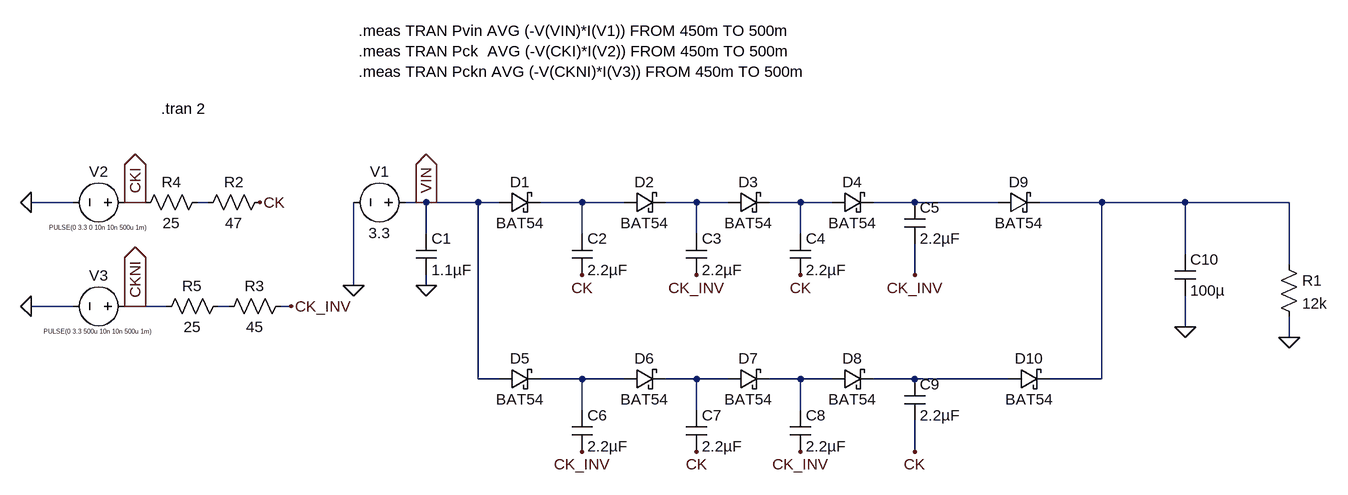
[diagram p0: schematic simulazione_chip_buffer.asc]
simulazione_chip_buffer.asc, the LTspice schematic file:
Version 4
SHEET 1 1172 680
WIRE -768 16 -832 16
WIRE -672 16 -688 16
WIRE -656 16 -672 16
WIRE -560 16 -576 16
WIRE -224 16 -256 16
WIRE -144 16 -224 16
WIRE -112 16 -144 16
WIRE 16 16 -48 16
WIRE 80 16 16 16
WIRE 192 16 144 16
WIRE 240 16 192 16
WIRE 352 16 304 16
WIRE 400 16 352 16
WIRE 528 16 464 16
WIRE 656 16 528 16
WIRE 816 16 720 16
WIRE 944 16 816 16
WIRE 1104 16 944 16
WIRE -224 64 -224 16
WIRE 16 64 16 16
WIRE 192 64 192 16
WIRE 352 64 352 16
WIRE 944 96 944 16
WIRE 1104 112 1104 16
WIRE 528 128 528 80
WIRE -336 144 -336 16
WIRE -224 144 -224 128
WIRE -768 176 -832 176
WIRE -672 176 -688 176
WIRE -624 176 -672 176
WIRE -528 176 -544 176
WIRE -432 176 -448 176
WIRE 944 208 944 160
WIRE 1104 224 1104 192
WIRE -144 288 -144 16
WIRE -112 288 -144 288
WIRE 16 288 -48 288
WIRE 80 288 16 288
WIRE 192 288 144 288
WIRE 240 288 192 288
WIRE 352 288 304 288
WIRE 400 288 352 288
WIRE 528 288 464 288
WIRE 672 288 528 288
WIRE 816 288 816 16
WIRE 816 288 736 288
WIRE 16 336 16 288
WIRE 192 336 192 288
WIRE 352 336 352 288
WIRE 528 400 528 352
FLAG -336 144 0
FLAG -832 176 0
FLAG -832 16 0
FLAG 16 128 CK
FLAG 352 128 CK
FLAG 192 128 CK_INV
FLAG 528 128 CK_INV
FLAG 16 400 CK_INV
FLAG 352 400 CK_INV
FLAG 192 400 CK
FLAG 528 400 CK
FLAG -224 144 0
FLAG 944 208 0
FLAG 1104 224 0
FLAG -480 16 CK
FLAG -432 176 CK_INV
FLAG -224 16 VIN
IOPIN -224 16 Out
FLAG -672 16 CKI
IOPIN -672 16 Out
FLAG -672 176 CKNI
IOPIN -672 176 Out
SYMBOL voltage -240 16 R90
WINDOW 0 -32 56 VBottom 2
WINDOW 3 32 56 VTop 2
WINDOW 123 0 0 Left 0
WINDOW 39 0 0 Left 0
SYMATTR InstName V1
SYMATTR Value 3.3
SYMBOL voltage -672 16 R90
WINDOW 0 -32 56 VBottom 2
WINDOW 3 32 56 VTop 0
WINDOW 123 0 0 Left 0
WINDOW 39 0 0 Left 0
SYMATTR InstName V2
SYMATTR Value PULSE(0 3.3 0 10n 10n 500u 1m)
SYMBOL voltage -672 176 R90
WINDOW 0 -32 56 VBottom 2
WINDOW 3 32 56 VTop 0
WINDOW 123 0 0 Left 0
WINDOW 39 0 0 Left 0
SYMATTR InstName V3
SYMATTR Value PULSE(0 3.3 500u 10n 10n 500u 1m)
SYMBOL schottky -112 32 R270
WINDOW 0 32 32 VTop 2
WINDOW 3 0 32 VBottom 2
SYMATTR InstName D1
SYMATTR Value BAT54
SYMATTR Description Diode
SYMATTR Type diode
SYMBOL schottky 80 32 R270
WINDOW 0 32 32 VTop 2
WINDOW 3 0 32 VBottom 2
SYMATTR InstName D2
SYMATTR Value BAT54
SYMATTR Description Diode
SYMATTR Type diode
SYMBOL schottky 240 32 R270
WINDOW 0 32 32 VTop 2
WINDOW 3 0 32 VBottom 2
SYMATTR InstName D3
SYMATTR Value BAT54
SYMATTR Description Diode
SYMATTR Type diode
SYMBOL schottky 400 32 R270
WINDOW 0 32 32 VTop 2
WINDOW 3 0 32 VBottom 2
SYMATTR InstName D4
SYMATTR Value BAT54
SYMATTR Description Diode
SYMATTR Type diode
SYMBOL cap -240 64 R0
SYMATTR InstName C1
SYMATTR Value 1.1µF
SYMBOL cap 0 64 R0
SYMATTR InstName C2
SYMATTR Value 2.2µF
SYMBOL cap 176 64 R0
SYMATTR InstName C3
SYMATTR Value 2.2µF
SYMBOL cap 336 64 R0
SYMATTR InstName C4
SYMATTR Value 2.2µF
SYMBOL cap 512 16 R0
SYMATTR InstName C5
SYMATTR Value 2.2µF
SYMBOL schottky -112 304 R270
WINDOW 0 32 32 VTop 2
WINDOW 3 0 32 VBottom 2
SYMATTR InstName D5
SYMATTR Value BAT54
SYMATTR Description Diode
SYMATTR Type diode
SYMBOL schottky 80 304 R270
WINDOW 0 32 32 VTop 2
WINDOW 3 0 32 VBottom 2
SYMATTR InstName D6
SYMATTR Value BAT54
SYMATTR Description Diode
SYMATTR Type diode
SYMBOL schottky 240 304 R270
WINDOW 0 32 32 VTop 2
WINDOW 3 0 32 VBottom 2
SYMATTR InstName D7
SYMATTR Value BAT54
SYMATTR Description Diode
SYMATTR Type diode
SYMBOL schottky 400 304 R270
WINDOW 0 32 32 VTop 2
WINDOW 3 0 32 VBottom 2
SYMATTR InstName D8
SYMATTR Value BAT54
SYMATTR Description Diode
SYMATTR Type diode
SYMBOL cap 0 336 R0
SYMATTR InstName C6
SYMATTR Value 2.2µF
SYMBOL cap 176 336 R0
SYMATTR InstName C7
SYMATTR Value 2.2µF
SYMBOL cap 336 336 R0
SYMATTR InstName C8
SYMATTR Value 2.2µF
SYMBOL cap 512 288 R0
SYMATTR InstName C9
SYMATTR Value 2.2µF
SYMBOL schottky 656 32 R270
WINDOW 0 32 32 VTop 2
WINDOW 3 0 32 VBottom 2
SYMATTR InstName D9
SYMATTR Value BAT54
SYMATTR Description Diode
SYMATTR Type diode
SYMBOL schottky 672 304 R270
WINDOW 0 32 32 VTop 2
WINDOW 3 0 32 VBottom 2
SYMATTR InstName D10
SYMATTR Value BAT54
SYMATTR Description Diode
SYMATTR Type diode
SYMBOL cap 928 96 R0
SYMATTR InstName C10
SYMATTR Value 100µ
SYMBOL res 1088 96 R0
SYMATTR InstName R1
SYMATTR Value 12k
SYMBOL res -576 32 R270
WINDOW 0 32 56 VTop 2
WINDOW 3 0 56 VBottom 2
SYMATTR InstName R2
SYMATTR Value 47
SYMBOL res -544 192 R270
WINDOW 0 32 56 VTop 2
WINDOW 3 0 56 VBottom 2
SYMATTR InstName R3
SYMATTR Value 45
SYMBOL res -560 0 R90
WINDOW 0 0 56 VBottom 2
WINDOW 3 32 56 VTop 2
SYMATTR InstName R4
SYMATTR Value 25
SYMBOL res -528 160 R90
WINDOW 0 0 56 VBottom 2
WINDOW 3 32 56 VTop 2
SYMATTR InstName R5
SYMATTR Value 25
TEXT -632 -128 Left 2 !.tran 2
TEXT -328 -248 Left 2 !.meas TRAN Pvin AVG (-V(VIN)*I(V1)) FROM 450m TO 500m\n.meas TRAN Pck  AVG (-V(CKI)*I(V2)) FROM 450m TO 500m\n.meas TRAN Pckn AVG (-V(CKNI)*I(V3)) FROM 450m TO 500m

The netlist it stands for:
* simulazione_chip_buffer.asc
V1 VIN 0 3.3
V2 CKI 0 PULSE(0 3.3 0 10n 10n 500u 1m)
V3 CKNI 0 PULSE(0 3.3 500u 10n 10n 500u 1m)
D1 VIN N002 BAT54
D2 N002 N003 BAT54
D3 N003 N004 BAT54
D4 N004 N005 BAT54
C1 VIN 0 1.1µF
C2 N002 CK 2.2µF
C3 N003 CK_INV 2.2µF
C4 N004 CK 2.2µF
C5 N005 CK_INV 2.2µF
D5 VIN N008 BAT54
D6 N008 N009 BAT54
D7 N009 N010 BAT54
D8 N010 N011 BAT54
C6 N008 CK_INV 2.2µF
C7 N009 CK 2.2µF
C8 N010 CK_INV 2.2µF
C9 N011 CK 2.2µF
D9 N005 N006 BAT54
D10 N011 N006 BAT54
C10 N006 0 100µ
R1 N006 0 12k
R2 N001 CK 47
R3 N007 CK_INV 45
R4 N001 CKI 25
R5 N007 CKNI 25
.model D D
.lib standard.dio
.tran 2
.meas TRAN Pvin AVG (-V(VIN)*I(V1)) FROM 450m TO 500m
.meas TRAN Pck  AVG (-V(CKI)*I(V2)) FROM 450m TO 500m
.meas TRAN Pckn AVG (-V(CKNI)*I(V3)) FROM 450m TO 500m
.backanno
.end